# EAGLE design PINO (EAGLE 9.5.1)
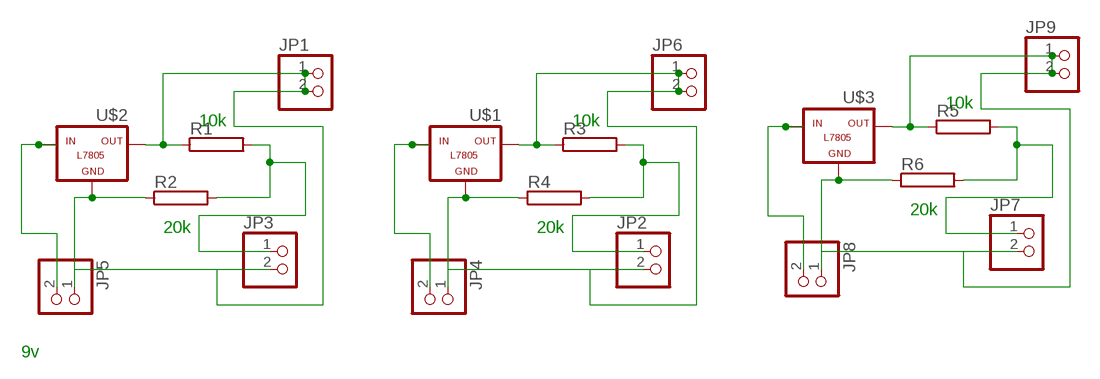
[diagram p0: schematic, sheet 1]

## Parts
JP1  PINHD-1X2M  [1X02M]
JP2  PINHD-1X2M  [1X02M]
JP3  PINHD-1X2M  [1X02M]
JP4  PINHD-1X2M  [1X02M]
JP5  PINHD-1X2M  [1X02M]
JP6  PINHD-1X2M  [1X02M]
JP7  PINHD-1X2M  [1X02M]
JP8  PINHD-1X2M  [1X02M]
JP9  PINHD-1X2M  [1X02M]
R1  RCA4050  [CA4050]
R2  RCA4050  [CA4050]
R3  RCA4050  [CA4050]
R4  RCA4050  [CA4050]
R5  RCA4050  [CA4050]
R6  RCA4050  [CA4050]
U$1  -L7805  [L7805]
U$2  -L7805  [L7805]
U$3  -L7805  [L7805]

## Nets
N$1: JP5.2 U$2.IN
N$2: JP1.1 JP1.2 JP3.2 JP5.1 R1.1 R2.1 U$2.GND U$2.OUT
N$3: JP4.2 U$1.IN
N$4: JP2.1 R3.2 R4.2
N$5: JP3.1 R1.2 R2.2
N$6: JP2.2 JP4.1 JP6.1 JP6.2 R3.1 R4.1 U$1.GND U$1.OUT
N$7: JP8.2 U$3.IN
N$8: JP7.1 R5.2 R6.2
N$9: JP7.2 JP8.1 JP9.1 JP9.2 R5.1 R6.1 U$3.GND U$3.OUT

## Notes on the sheet
- 10k
- 10k | 10k
- 20k
- 20k | 20k
- 9v

## Library data of the parts
JP1-JP9 = pinhead:PINHD-1X2: PIN HEADER
R1-R6 = resistor-power:R: Power Resitor; OC_FARNELL: unknown; OC_NEWARK: unknown
U$1-U$3 = tango (1):-L7805

## Board
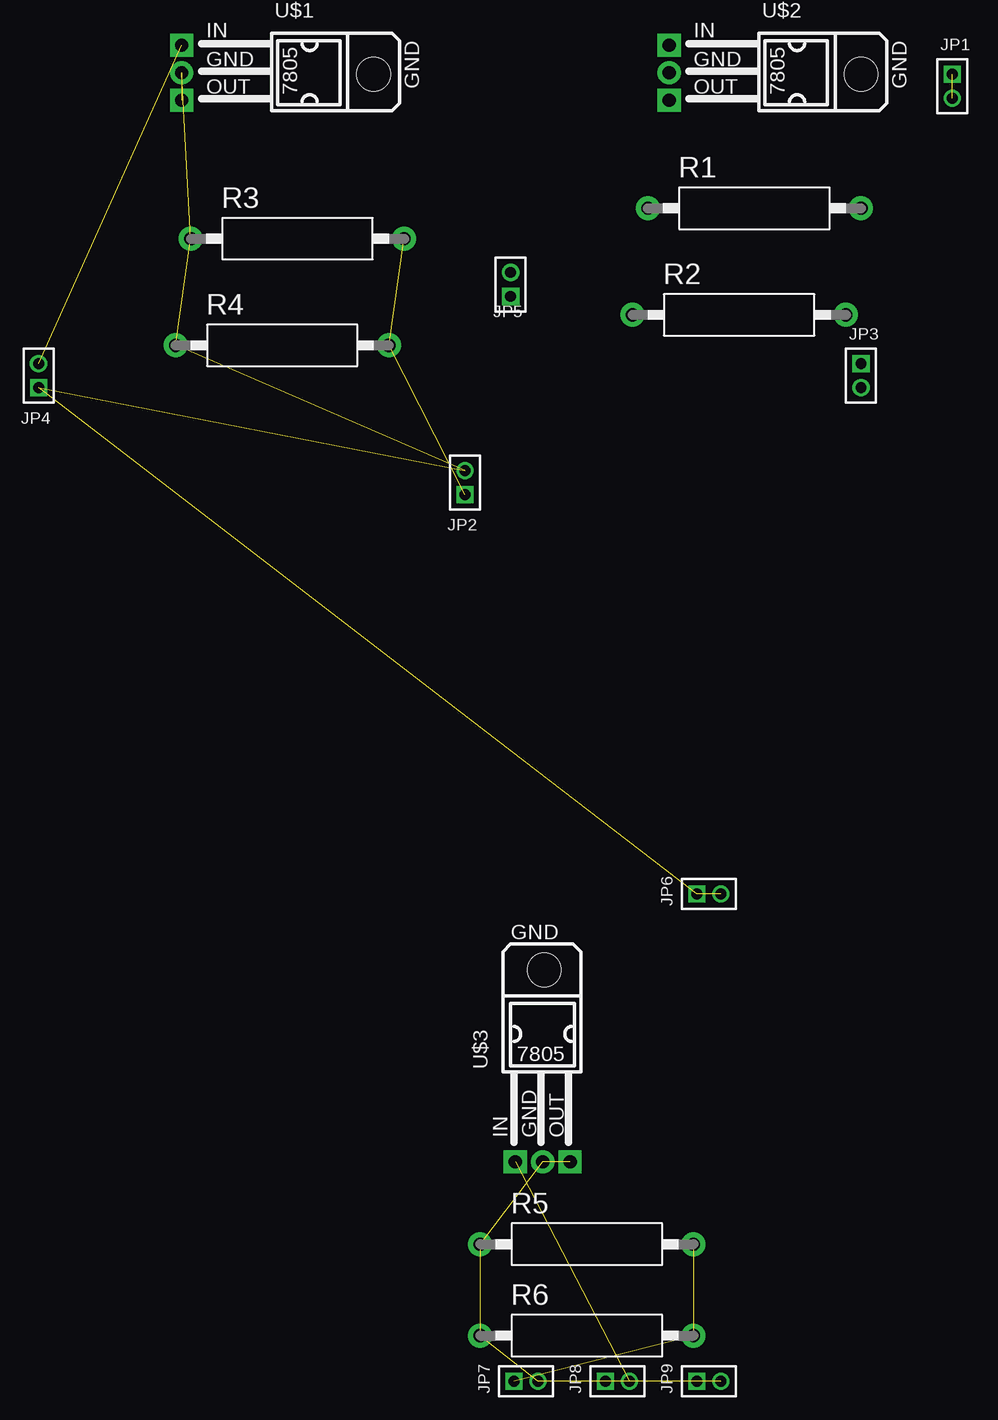
[diagram p1: board, top side]
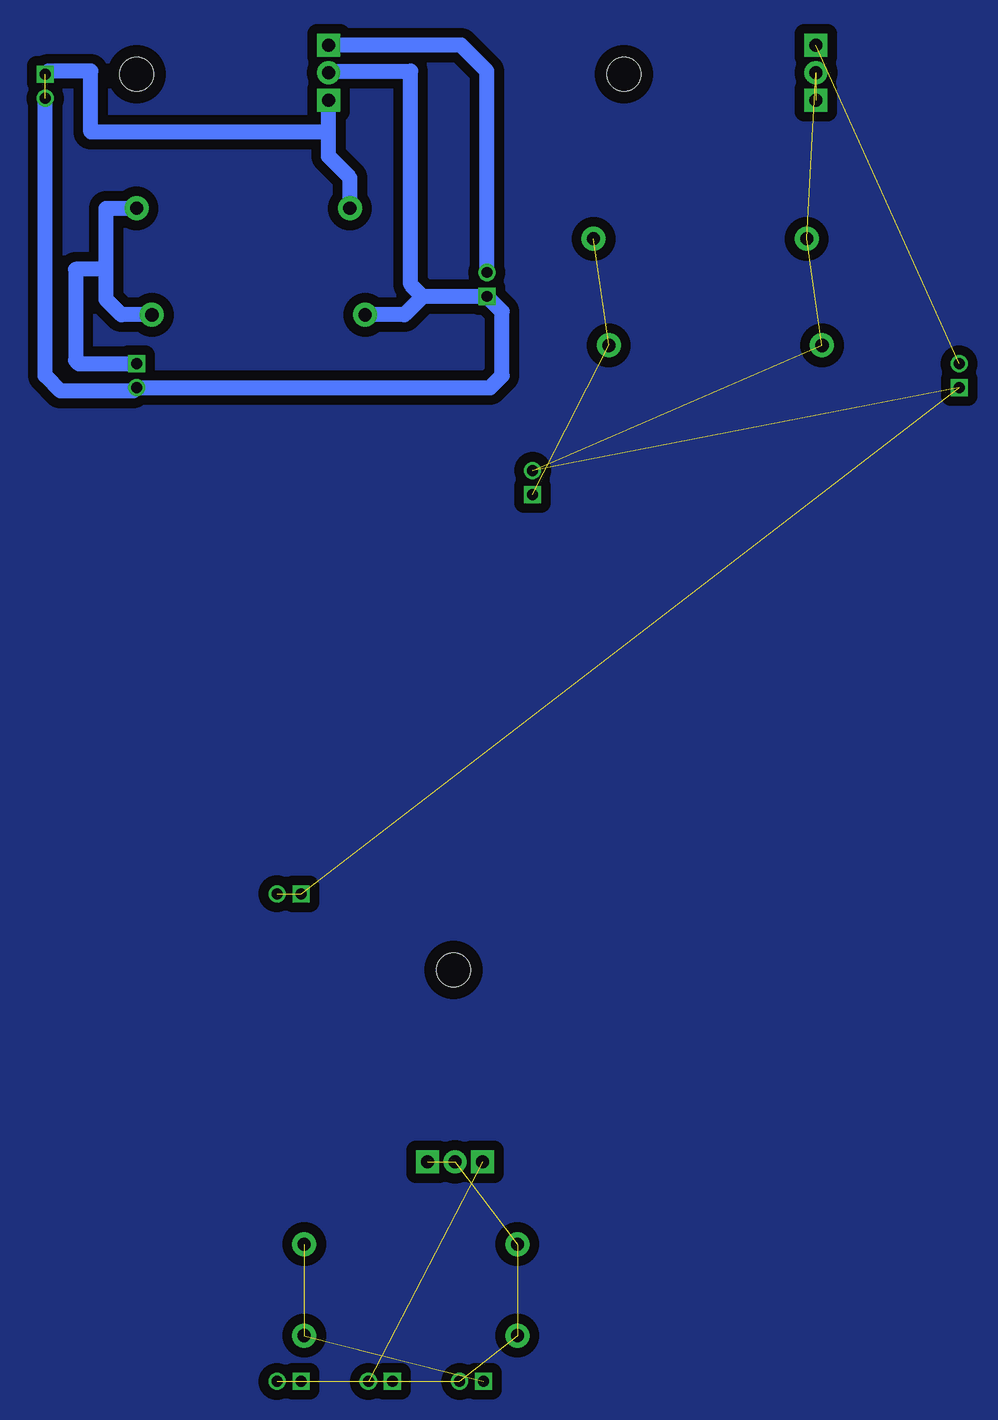
[diagram p2: board, bottom side, seen from below]

No outline drawn. Coordinates in mm, seen from the top.
Copper layers (1*16): Top 0.035mm / dielectric 1.5mm / Bottom 0.035mm
Design rules "default": minimum track width 10mil, minimum drill 24mil, track to track 8mil, track to pad 8mil, pad to pad 8mil, via to via 8mil, smd to smd 8mil, copper to edge 40mil, drill to drill 8mil, minimum pad ring 10mil, minimum via ring 8mil, stop-mask expansion 4mil, vias tented up to drill 0mil, thermal gap 10mil

### Footprints (pad centres in the part's own frame; a part is rotated, then mirrored left to right if it is on the bottom)
1X02M = drill 0.914 square: 1 -1,0 | drill 0.914: 2 1,0
CA4050 = drill 1.1 pad 2: 1 -8.89,0; 2 8.89,0
L7805 = drill 1.1 pad 1.93: GND 0.127,-9.652 | drill 1.1 pad 1.93 square: IN -2.159,-9.652; OUT 2.413,-9.652 | hole 2.8: 0.254,6.35

### Placement (x,y rotation side)
JP1  78.74,38.1 270 top
JP2  38.1,5.08 90 top
JP3  71.12,13.97 270 top
JP4  2.54,13.97 90 top
JP5  41.91,21.59 90 top
JP6  58.42,-29.21 0 top
JP7  43.18,-69.85 0 top
JP8  50.8,-69.85 0 top
JP9  58.42,-69.85 0 top
R1  62.23,27.94 0 top
R2  60.96,19.05 0 top
R3  24.13,25.4 0 top
R4  22.86,16.51 0 top
R5  48.26,-58.42 0 top
R6  48.26,-66.04 0 top
U$1  24.13,39.37 270 top
U$2  64.77,39.37 270 top
U$3  44.45,-41.91 0 top

### Tracks (layer width: path | path; a pad name or v marks a point on that pad's centre or on a via)
GND
  pour Bottom (isolate 0.813, no thermals): -137.16,-77.47 82.55,-77.47 82.55,48.26 -137.16,48.26
N$1
  Bottom 1.27: JP5.2 41.91,39.37 44.07,41.53 U$2.IN
N$2  (1 unrouted)
  Bottom 0.254: JP3.2 71.12,12.7
  Bottom 0.813: JP3.2 71.39,12.7
  Bottom 1.27: 71.39,12.7 77.47,12.7 78.74,13.97 JP1.2 | JP3.2 41.64,12.97 40.64,13.97 40.64,19.32 JP5.1 47.26,20.59 | JP1.1 78.47,39.37 74.93,39.37 74.93,34.29 55.12,34.29 | 47.26,20.59 48.26,21.59 48.26,39.37 54.99,39.37 U$2.GND | R1.1 53.34,30.48 55.12,32.26 55.12,34.29 | 55.12,34.29 U$2.OUT | 47.26,20.59 48.8,19.05 R2.1
N$3  (1 unrouted)
N$4  (2 unrouted)
N$5
  Bottom 1.27: R2.2 72.39,19.05 73.66,20.32 73.66,22.86 | 73.66,22.86 73.66,27.94 R1.2 | 73.66,22.86 76.2,22.86 76.2,15.24 75.93,14.97 JP3.1
N$6  (7 unrouted)
N$7  (1 unrouted)
N$8  (2 unrouted)
N$9  (7 unrouted)